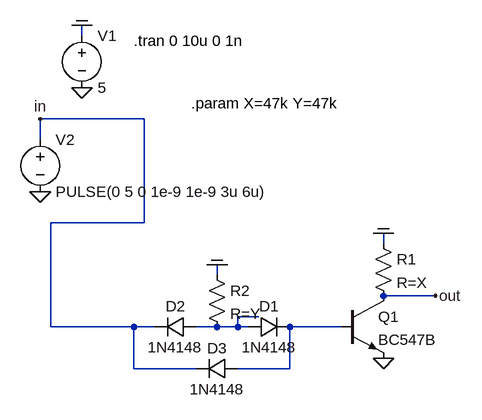
[diagram p0: schematic dtl4.asc]
dtl4.asc, the LTspice schematic file:
Version 4
SHEET 1 880 680
WIRE 272 -64 272 -80
WIRE 368 64 208 64
WIRE 208 96 208 64
WIRE 368 224 368 64
WIRE 368 224 224 224
WIRE 736 256 736 240
WIRE 480 304 480 288
WIRE 816 336 736 336
WIRE 544 368 512 368
WIRE 224 384 224 224
WIRE 352 384 224 384
WIRE 384 384 352 384
WIRE 480 384 448 384
WIRE 512 384 512 368
WIRE 512 384 480 384
WIRE 528 384 512 384
WIRE 672 384 592 384
WIRE 352 448 352 384
WIRE 448 448 352 448
WIRE 592 448 592 384
WIRE 592 448 512 448
FLAG 272 16 0
FLAG 272 -80 COM
FLAG 208 176 0
FLAG 208 64 in
FLAG 736 432 0
FLAG 736 240 COM
FLAG 480 288 COM
FLAG 816 336 out
SYMBOL voltage 272 -80 R0
WINDOW 123 0 0 Left 2
WINDOW 39 0 0 Left 2
SYMATTR InstName V1
SYMATTR Value 5
SYMBOL voltage 208 80 R0
WINDOW 123 0 0 Left 2
WINDOW 39 0 0 Left 2
SYMATTR InstName V2
SYMATTR Value PULSE(0 5 0 1e-9 1e-9 3u 6u)
SYMBOL diode 528 400 R270
WINDOW 0 32 32 VTop 2
WINDOW 3 0 32 VBottom 2
SYMATTR InstName D1
SYMATTR Value 1N4148
SYMBOL npn 672 336 R0
SYMATTR InstName Q1
SYMATTR Value BC547B
SYMBOL res 720 240 R0
SYMATTR InstName R1
SYMATTR Value R=X
SYMBOL diode 448 368 R90
WINDOW 0 0 32 VBottom 2
WINDOW 3 32 32 VTop 2
SYMATTR InstName D2
SYMATTR Value 1N4148
SYMBOL res 464 288 R0
SYMATTR InstName R2
SYMATTR Value R=Y
SYMBOL diode 512 432 R90
WINDOW 0 0 32 VBottom 2
WINDOW 3 32 32 VTop 2
SYMATTR InstName D3
SYMATTR Value 1N4148
TEXT 352 -56 Left 2 !.tran 0 10u 0 1n
TEXT 440 40 Left 2 !.param X=47k Y=47k

The netlist it stands for:
* dtl4.asc
V1 COM 0 5
V2 in 0 PULSE(0 5 0 1e-9 1e-9 3u 6u)
D1 N001 N002 1N4148
Q1 out N002 0 0 BC547B
R1 COM out R=X
D2 N001 in 1N4148
R2 COM N001 R=Y
D3 N002 in 1N4148
.model D D
.lib standard.dio
.model NPN NPN
.model PNP PNP
.lib standard.bjt
.tran 0 10u 0 1n
.param X=47k Y=47k
.backanno
.end